# Altium schematic sheet [03] HMI Screen.SchDoc
size A4
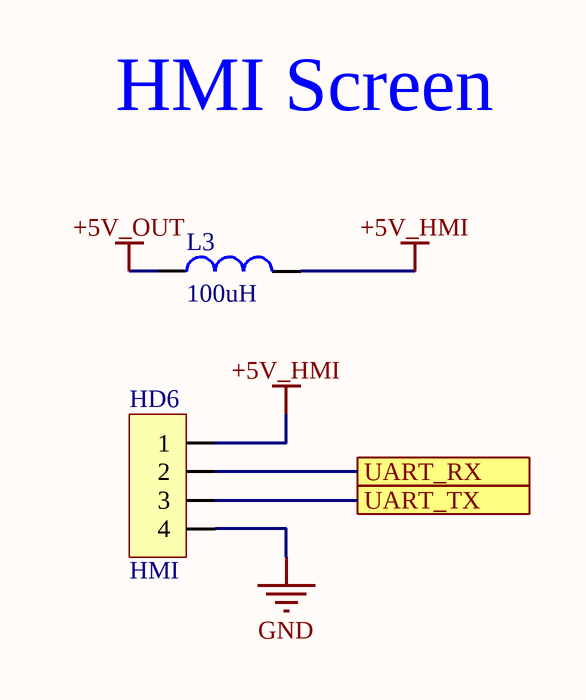
[diagram p0: [03] HMI Screen.SchDoc]

## Parts
HD6  HMI  [CON_4P]
L3  100uH  [RES-SMD-0805]

## Ports
UART_RX, UART_TX

## Nets
+5V_HMI: HD6.1 L3.2
+5V_OUT: L3.1
GND: HD6.4
UART_RX: HD6.2 ; port UART_RX
UART_TX: HD6.3 ; port UART_TX

## Notes on the sheet
- HMI Screen

## Library data of the parts
HD6 = JP4: Manufacturer: W¨¹rth Elektronik eiSos GmbH; partNo: 613004143121; ComponentLink1 Description: Manufacturer; ComponentLink2 Description: Datasheet; NoPins: 04; Created Date: 29 March 2013; ComponentLink1URL: http://www.we-online.com; ComponentLink2URL: http://katalog.we-online.de/em/datasheet/6130xx143121.pdf; Created by: Karrer Zheng
L3 = Inductor: Value: 150 mH